# EAGLE design khaliddalkhaldi (EAGLE 8.7.1)
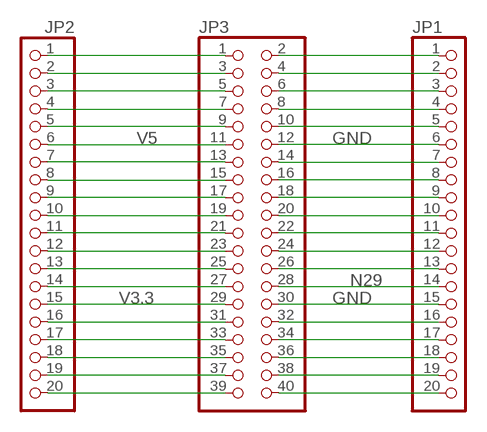
[diagram p0: schematic, sheet 1]

## Parts
JP1  PINHD-1X20  [1X20]
JP2  PINHD-1X20  [1X20]
JP3  PINHD-2X20  [2X20]

## Nets
GND: JP1.6 JP1.15 JP3.12 JP3.30
N29: JP1.14 JP3.28
N$1: JP2.1 JP3.1
N$2: JP2.2 JP3.3
N$3: JP2.3 JP3.5
N$4: JP2.4 JP3.7
N$5: JP2.5 JP3.9
N$7: JP2.7 JP3.13
N$8: JP2.8 JP3.15
N$9: JP2.9 JP3.17
N$10: JP2.10 JP3.19
N$11: JP2.11 JP3.21
N$12: JP2.12 JP3.23
N$13: JP2.13 JP3.25
N$14: JP2.14 JP3.27
N$16: JP2.16 JP3.31
N$17: JP2.17 JP3.33
N$18: JP2.18 JP3.35
N$19: JP2.19 JP3.37
N$20: JP2.20 JP3.39
N$21: JP1.20 JP3.40
N$22: JP1.19 JP3.38
N$23: JP1.18 JP3.36
N$24: JP1.17 JP3.34
N$25: JP1.16 JP3.32
N$28: JP1.13 JP3.26
N$29: JP1.12 JP3.24
N$30: JP1.11 JP3.22
N$31: JP1.10 JP3.20
N$32: JP1.9 JP3.18
N$33: JP1.8 JP3.16
N$34: JP1.7 JP3.14
N$36: JP1.5 JP3.10
N$37: JP1.4 JP3.8
N$38: JP1.3 JP3.6
N$39: JP1.2 JP3.4
N$40: JP1.1 JP3.2
V3.3: JP2.15 JP3.29
V5: JP2.6 JP3.11

## Library data of the parts
JP1 JP2 = pin1+20:PINHD-1X20: PIN HEADER
JP3 = pin1+20:PINHD-2X20: PIN HEADER

## Board
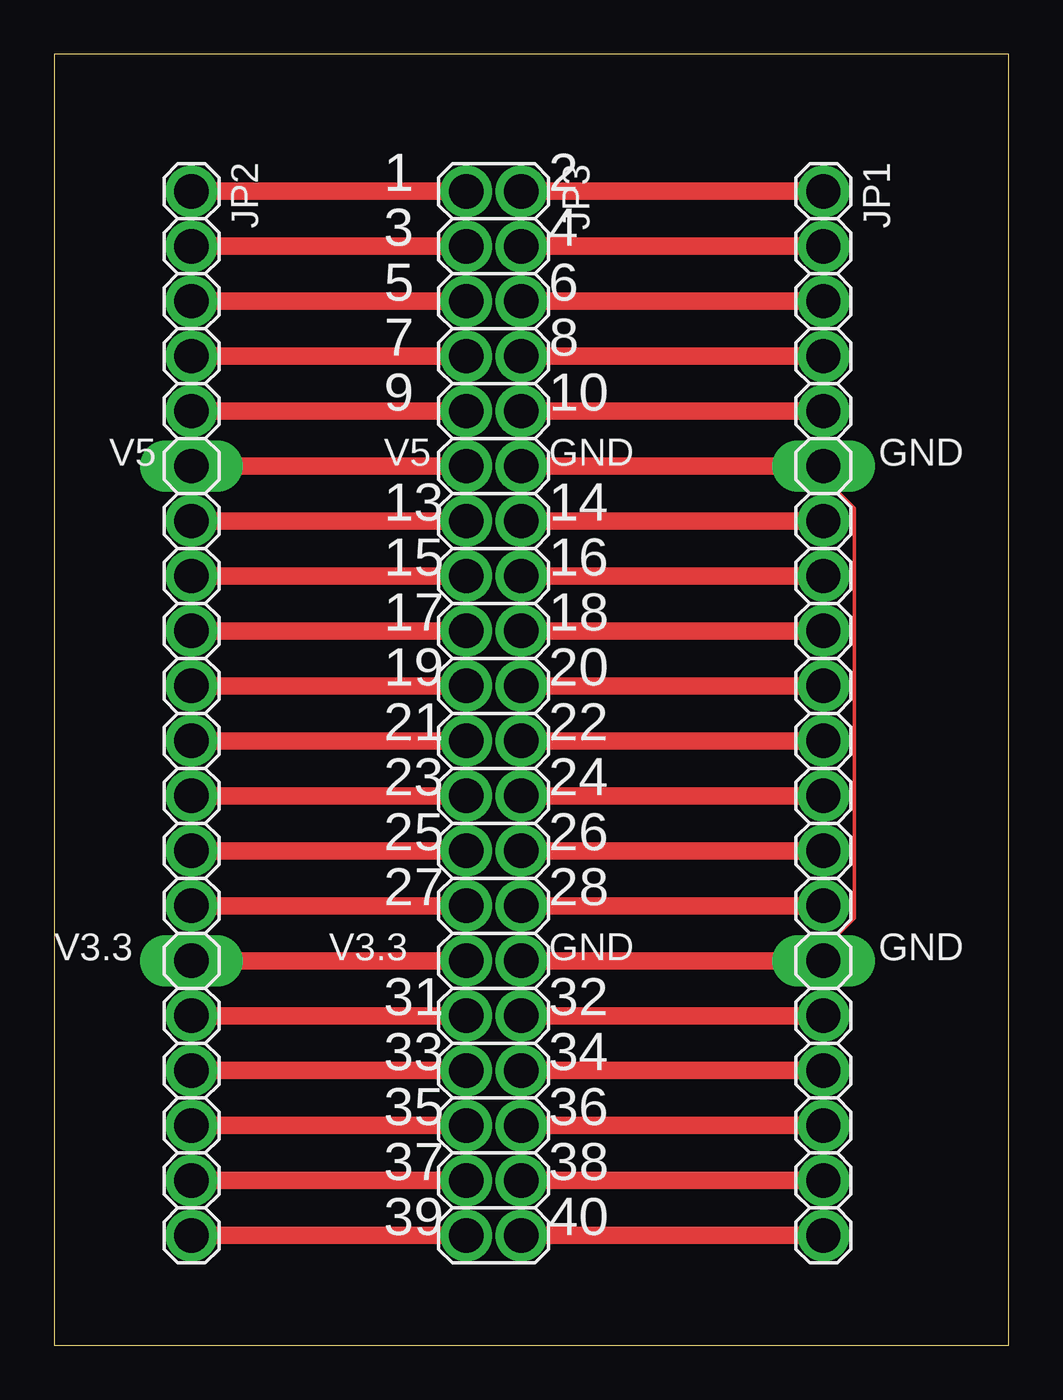
[diagram p1: board, top side]

Size 44.12 x 59.68 mm. Coordinates in mm from the lower left corner, seen from the top.
Outline: 0,0 44.12,0 44.12,59.68 0,59.68 0,0
Copper layers (1*16): Top 0.035559375mm / dielectric 1.6mm / Bottom 0.035559375mm
Design rules "oshpark-2layer": minimum track width 6mil, minimum drill 10mil, track to track 6mil, track to pad 6mil, pad to pad 6mil, via to via 6mil, smd to smd 6mil, copper to edge 15mil, drill to drill 6mil, minimum pad ring 5mil, minimum via ring 5mil, stop-mask expansion 2.5mil, vias tented up to drill 0mil, thermal gap 10mil

### Footprints (pad centres in the part's own frame; a part is rotated, then mirrored left to right if it is on the bottom)
1X20 = drill 1.587: 1 -24.13,0; 2 -21.59,0; 3 -19.05,0; 4 -16.51,0; 5 -13.97,0; 7 -8.89,0; 8 -6.35,0; 9 -3.81,0; 10 -1.27,0; 11 1.27,0; 12 3.81,0; 13 6.35,0; 14 8.89,0; 16 13.97,0; 17 16.51,0; 18 19.05,0; 19 21.59,0; 20 24.13,0 | drill 1.587 long: 6 -11.43,0; 15 11.43,0
2X20 = drill 1.587: 1 -24.13,-1.27; 2 -24.13,1.27; 3 -21.59,-1.27; 4 -21.59,1.27; 5 -19.05,-1.27; 6 -19.05,1.27; 7 -16.51,-1.27; 8 -16.51,1.27; 9 -13.97,-1.27; 10 -13.97,1.27; 11 -11.43,-1.27; 12 -11.43,1.27; 13 -8.89,-1.27; 14 -8.89,1.27; 15 -6.35,-1.27; 16 -6.35,1.27; 17 -3.81,-1.27; 18 -3.81,1.27; 19 -1.27,-1.27; 20 -1.27,1.27; 21 1.27,-1.27; 22 1.27,1.27; 23 3.81,-1.27; 24 3.81,1.27; 25 6.35,-1.27; 26 6.35,1.27; 27 8.89,-1.27; 28 8.89,1.27; 29 11.43,-1.27; 30 11.43,1.27; 31 13.97,-1.27; 32 13.97,1.27; 33 16.51,-1.27; 34 16.51,1.27; 35 19.05,-1.27; 36 19.05,1.27; 37 21.59,-1.27; 38 21.59,1.27; 39 24.13,-1.27; 40 24.13,1.27

### Placement (x,y rotation side)
JP1  35.56,29.21 270 top
JP2  6.35,29.21 270 top
JP3  20.32,29.21 270 top

### Tracks (layer width: path | path; a pad name or v marks a point on that pad's centre or on a via)
GND
  Top 0.152: JP3.12 22.86,40.64 | JP1.6 35.56,40.11 36.98,38.69 36.98,19.73 35.56,18.31 JP1.15
  Top 0.798: 22.86,40.64 JP1.6 | JP3.30 JP1.15
N29
  Top 0.798: JP1.14 JP3.28
N$1
  Top 0.798: JP3.1 JP2.1
N$2
  Top 0.798: JP3.3 JP2.2
N$3
  Top 0.798: JP3.5 JP2.3
N$4
  Top 0.798: JP2.4 JP3.7
N$5
  Top 0.798: JP3.9 JP2.5
N$7
  Top 0.798: JP3.13 JP2.7
N$8
  Top 0.798: JP2.8 JP3.15
N$9
  Top 0.798: JP3.17 JP2.9
N$10
  Top 0.798: JP2.10 JP3.19
N$11
  Top 0.798: JP3.21 JP2.11
N$12
  Top 0.798: JP2.12 JP3.23
N$13
  Top 0.798: JP3.25 JP2.13
N$14
  Top 0.798: JP2.14 JP3.27
N$16
  Top 0.798: JP2.16 JP3.31
N$17
  Top 0.798: JP3.33 JP2.17
N$18
  Top 0.798: JP2.18 JP3.35
N$19
  Top 0.798: JP3.37 JP2.19
N$20
  Top 0.798: JP2.20 JP3.39
N$21
  Top 0.798: JP1.20 JP3.40
N$22
  Top 0.798: JP3.38 JP1.19
N$23
  Top 0.798: JP1.18 JP3.36
N$24
  Top 0.798: JP3.34 JP1.17
N$25
  Top 0.798: JP1.16 JP3.32
N$28
  Top 0.798: JP3.26 JP1.13
N$29
  Top 0.798: JP1.12 JP3.24
N$30
  Top 0.798: JP3.22 JP1.11
N$31
  Top 0.798: JP1.10 JP3.20
N$32
  Top 0.798: JP3.18 JP1.9
N$33
  Top 0.798: JP1.8 JP3.16
N$34
  Top 0.798: JP3.14 JP1.7
N$36
  Top 0.798: JP3.10 JP1.5
N$37
  Top 0.798: JP1.4 JP3.8
N$38
  Top 0.798: JP1.3 JP3.6
N$39
  Top 0.798: JP1.2 JP3.4
N$40
  Top 0.798: JP1.1 JP3.2
V3.3
  Top 0.798: JP3.29 JP2.15
V5
  Top 0.798: JP2.6 JP3.11

### Text on the board
tPlace: 1 | 2 | 3 | 4 | 5 | 6 | 7 | 8 | 9 | 10 | V5 | V5 | GND | GND | 13 | 14 | 15 | 16 | 17 | 18 | 19 | 20 | 21 | 22 | 23 | 24 | 25 | 26 | 27 | 28 | V3.3 | V3.3 | GND | GND | 31 | 32 | 33 | 34 | 35 | 36 | 37 | 38 | 39 | 40